# Altium schematic sheet Others.SchDoc
size A4; SheetNumber: 9; SheetTotal: 10
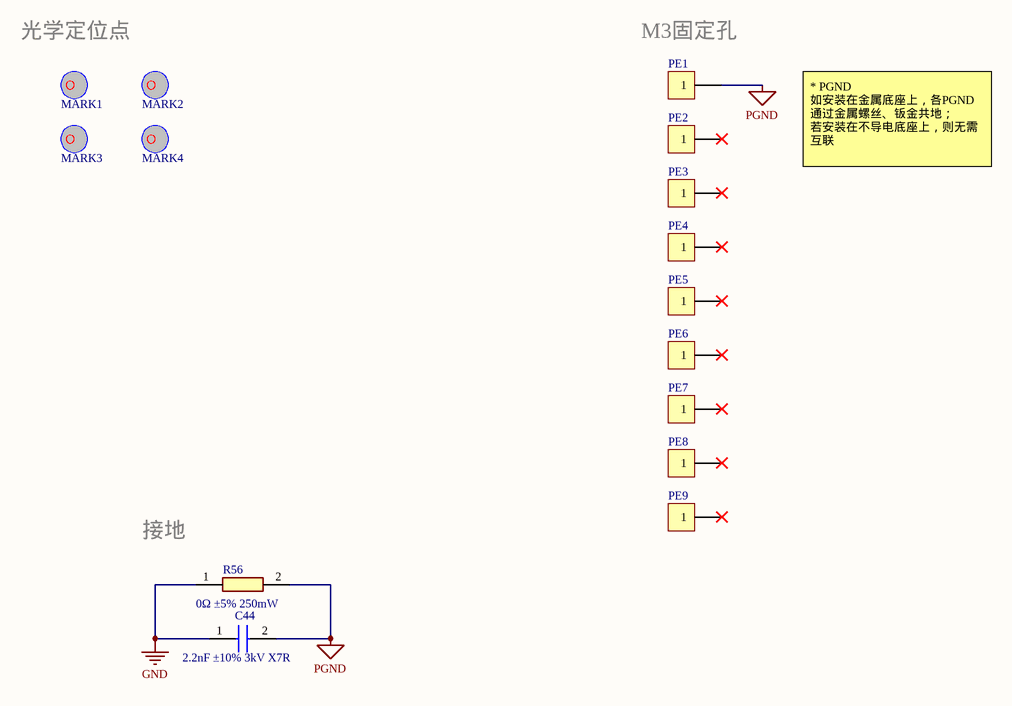
[diagram p0: Others.SchDoc]

## Parts
C44  2.2nF ±10% 3kV X7R  [CAPC4532X320N]
MARK1  MARK_POINT  [MARK_POINT]  (value not drawn)  (no BOM)
MARK2  MARK_POINT  [MARK_POINT]  (value not drawn)  (no BOM)
MARK3  MARK_POINT  [MARK_POINT]  (value not drawn)  (no BOM)
MARK4  MARK_POINT  [MARK_POINT]  (value not drawn)  (no BOM)
PE1  (no value)  [固定孔-M3]  (no BOM)
PE2  (no value)  [固定孔-M3]  (no BOM)
PE3  (no value)  [固定孔-M3]  (no BOM)
PE4  (no value)  [固定孔-M3]  (no BOM)
PE5  (no value)  [固定孔-M3]  (no BOM)
PE6  (no value)  [固定孔-M3]  (no BOM)
PE7  (no value)  [固定孔-M3]  (no BOM)
PE8  (no value)  [固定孔-M3]  (no BOM)
PE9  (no value)  [固定孔-M3]  (no BOM)
R56  0Ω ±5% 250mW  [RESC3116X65N]

## Nets
GND: C44.1 R56.1
PGND: C44.2 PE1.1 R56.2

Not connected (* = marked no-connect by the designer): PE2 1*; PE3 1*; PE4 1*; PE5 1*; PE6 1*; PE7 1*; PE8 1*; PE9 1*

## Notes on the sheet
- (near MARK1) 光学定位点
- (near PE1) M3固定孔
- * PGND
  如安装在金属底座上，各PGND通过金属螺丝、钣金共地；
  若安装在不导电底座上，则无需互联
- 接地

## Library data of the parts
C44 = HV1812Y222KXHATHV: HV1812Y222KXHATHV / 2.2nF / 精度: ±10% / 额定电压: 3kV / 材质(温度系数): X7R / 1812; Manufacturer_Name: Vishay; Datasheet Link: https://www.vishay.com/docs/45228/hvseries.pdf; Height: 3.2mm; Manufacturer_Part_Number: HV1812Y222KXHATHV; Mouser Part Number: 77-HV1812Y222KXHATHV; Mouser Price/Stock: https://www.mouser.co.uk/ProductDetail/Vishay-Vitramon/HV1812Y222KXHATHV?qs=%252BaFUgn%2FzHmzQEhPV2A6xhg%3D%3D; Arrow Part Number: HV1812Y222KXHATHV; Arrow Price/Stock: https://www.arrow.com/en/products/hv1812y222kxhathv/vishay
PE1-PE9 = CON1: Connector
R56 = RC1206JR-070RL: Manufacturer_Name: YAGEO; Datasheet Link: https://www.yageo.com/upload/media/product/productsearch/datasheet/rchip/PYu-RC_Group_51_RoHS_L_12.pdf; Height: 0.65mm; Manufacturer_Part_Number: RC1206JR-070RL; Mouser Part Number: 603-RC1206JR-070RL; Mouser Price/Stock: https://www.mouser.co.uk/ProductDetail/YAGEO/RC1206JR-070RL?qs=stZGH%252BcYwe4ZstaKNiOb8Q%3D%3D; Arrow Part Number: RC1206JR-070RL; Arrow Price/Stock: https://www.arrow.com/en/products/rc1206jr-070rl/yageo?region=nac